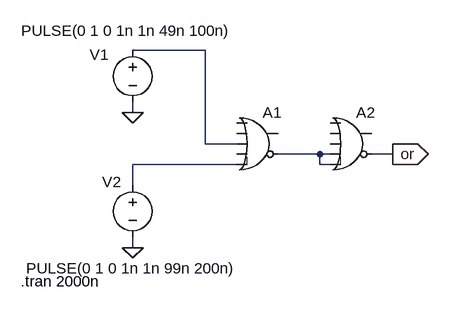
[diagram p0: schematic or_using_nor.asc]
or_using_nor.asc, the LTspice schematic file:
Version 4
SHEET 1 880 680
WIRE 128 48 16 48
WIRE 16 144 16 128
WIRE 128 192 128 48
WIRE 176 192 128 192
WIRE 304 208 240 208
WIRE 320 208 304 208
WIRE 416 208 384 208
WIRE 176 224 16 224
WIRE 304 224 304 208
WIRE 320 224 304 224
WIRE 16 256 16 224
WIRE 16 352 16 336
FLAG 16 144 0
FLAG 16 352 0
FLAG 416 208 or
IOPIN 416 208 Out
SYMBOL voltage 16 32 R0
WINDOW 0 -66 23 Left 2
WINDOW 3 -171 -14 Left 2
WINDOW 123 0 0 Left 0
WINDOW 39 0 0 Left 0
SYMATTR InstName V1
SYMATTR Value PULSE(0 1 0 1n 1n 49n 100n)
SYMBOL voltage 16 240 R0
WINDOW 0 -47 11 Left 2
WINDOW 3 -164 144 Left 2
WINDOW 123 0 0 Left 0
WINDOW 39 0 0 Left 0
SYMATTR InstName V2
SYMATTR Value PULSE(0 1 0 1n 1n 99n 200n)
SYMBOL Digital\\or 208 128 R0
SYMATTR InstName A1
SYMBOL Digital\\or 352 128 R0
SYMATTR InstName A2
TEXT -156 404 Left 2 !.tran 2000n

The netlist it stands for:
* or_using_nor.asc
V1 N001 0 PULSE(0 1 0 1n 1n 49n 100n)
V2 N003 0 PULSE(0 1 0 1n 1n 99n 200n)
A1 0 0 N001 0 N003 N002 0 0 OR
A2 0 0 0 N002 N002 or 0 0 OR
.tran 2000n
.backanno
.end